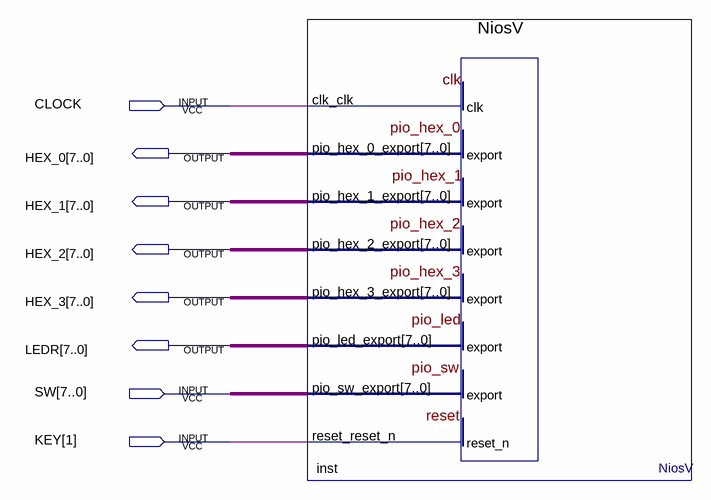
[diagram p0: schematic sheet]
// Quartus schematic NiosV_top.bdf as structural Verilog: 1 symbols, 8 pins
module NiosV_top (
  input  CLOCK,
  input  [7:0] SW,
  input  [1:1] KEY,
  output [7:0] HEX_0,
  output [7:0] HEX_1,
  output [7:0] HEX_2,
  output [7:0] HEX_3,
  output [7:0] LEDR
);

  NiosV inst (
    .clk_clk(CLOCK), .pio_sw_export(SW), .reset_reset_n(KEY[1]), .pio_hex_0_export(HEX_0),
    .pio_hex_1_export(HEX_1), .pio_hex_2_export(HEX_2), .pio_hex_3_export(HEX_3), .pio_led_export(LEDR));
endmodule
